# Altium schematic sheet VREG AOZ1284PI +4V2 4A.SchDoc
size 124 x 85 mm
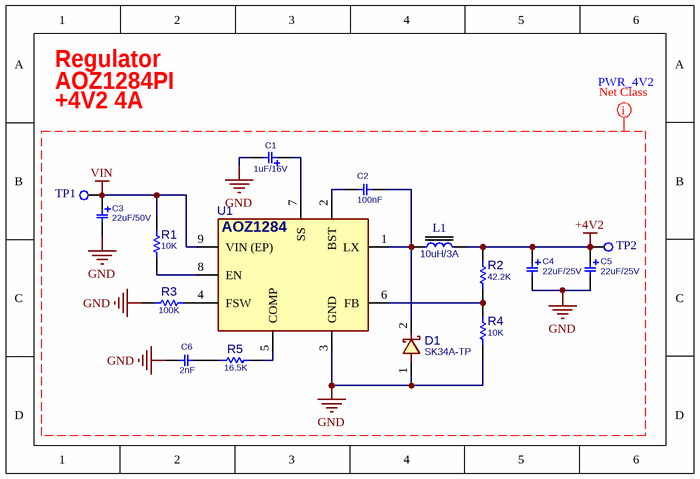
[diagram p0: VREG AOZ1284PI +4V2 4A.SchDoc]

## Parts
C1  1uF/16V  [C_TN_A]
C2  100nF  [C0603S]
C3  22uF/50V  [C_TN_A]
C4  22uF/25V  [C_TN_A]
C5  22uF/25V  [C_TN_A]
C6  2nF  [C0603S]
D1  SK34A-TP  [D_SMA]
L1  10uH/3A  [L_8X8]
R1  10K  [R0603S]
R2  42.2K  [R0603S]
R3  100K  [R0603S]
R4  10K  [R0603S]
R5  16.5K  [R0603S]
TP1  Test Point  [TPSMD_C1]  (value not drawn)
TP2  Test Point  [TPSMD_C1]  (value not drawn)
U1  AOZ1021AI  [SO_8T]  (value not drawn)

## Nets
+4V2: C4.1 C5.1 L1.2 R2.1 TP2.1(TP)
GND: C1.2 C3.2 C4.2 C5.2 C6.2 D1.1 R3.1 R4.2 U1.3(GND)
VIN: C3.1 R1.1 TP1.1(TP) U1.9(VIN_(EP))
NetC1_1: C1.1 U1.7(SS)
NetC2_1: C2.1 D1.2 L1.1 U1.1(LX)
NetC2_2: C2.2 U1.2(BST)
NetC6_1: C6.1 R5.1
NetR1_2: R1.2 U1.8(EN)
NetR2_2: R2.2 R4.1 U1.6(FB)
NetR3_2: R3.2 U1.4(FSW)
NetR5_2: R5.2 U1.5(COMP)

## Layout directives
net class PWR_4V2: +4V2, GND, VIN

## Notes on the sheet
- Regulator
- AOZ1284PI
- +4V2 4A
- PWR_4V2
- (in symbol VREG_AOZ1284PI_SO8) AOZ1284

## Library data of the parts
C1 = CAP_SMD_TAN: CAP, SMD, TAN; PARAM: 16V; VALUE: 1uF/16V
C2 C6 = CAP_SMD_MLCC: CAP, SMD, MLCC; PARAM: 50V; DESC: CAP, MLCC, 1nF, 50V, C0G, 10%, 0402; MANF_P#: MANF_PART#; MANF: Murata; PARAM2: C0G, 10%; PRICE: 100= 1$; ASSEMBLY: ASSEMBLY
  C2: VALUE: 100nF
  C6: VALUE: 2nF
C3 = CAP_SMD_TAN: CAP, SMD, TAN; PARAM: 50V; VALUE: 22uF/50V
C4 C5 = CAP_SMD_TAN: CAP, SMD, TAN; PARAM: 25V; VALUE: 22uF/25V
D1 = DIODE_SMD_SCHOTTKY_SK34A-TP: DIODE, SCHOTTKY, 40V, 3A; MANF: Vishay; DESC: DESCRIPTION; PARAM2: 1A; MANF_P#: SS14-E3; ASSEMBLY: ASSEMBLY; PRICE: PRICE; PARAM: 40V; VALUE: SK34A-TP
L1 = INDPWR_SMD: IND, PWR, SMD; VALUE: 10uH/3A
R1-R5 = RES_SMD: RES, SMD; MANF_P#: RK73H1ETTP4701F; MANF: KOA SPEER; PARAM: 0.063W; DESC: DESCRIPTION; DIST#: MOUSER; PARAM2: 1%; ASSEMBLY: ASSEMBLY; PRICE: 100= 0.5$
  R1 R4: VALUE: 10K
  R2: VALUE: 42.2K
  R3: VALUE: 100K
  R5: VALUE: 16.5K
U1 = VREG_AOZ1284PI_SO8: REG, Switching, Buck, 4A, ADJ, 500KHz, 3~36VIN, SO-8; MANF: AOSMD; PARAM: 3A, ADJ; PARAM2: 500KHz, 4.5~16VIN; ASSEMBLY: ASSEMBLY; PRICE: 1.33$, 1800t@PAYA; MANF_P#: AOZ1021AI; VALUE: AOZ1021AI